# Altium schematic sheet SHEET_SYMBOL.SchDoc
size A3; SheetNumber: 1; SheetTotal: 10
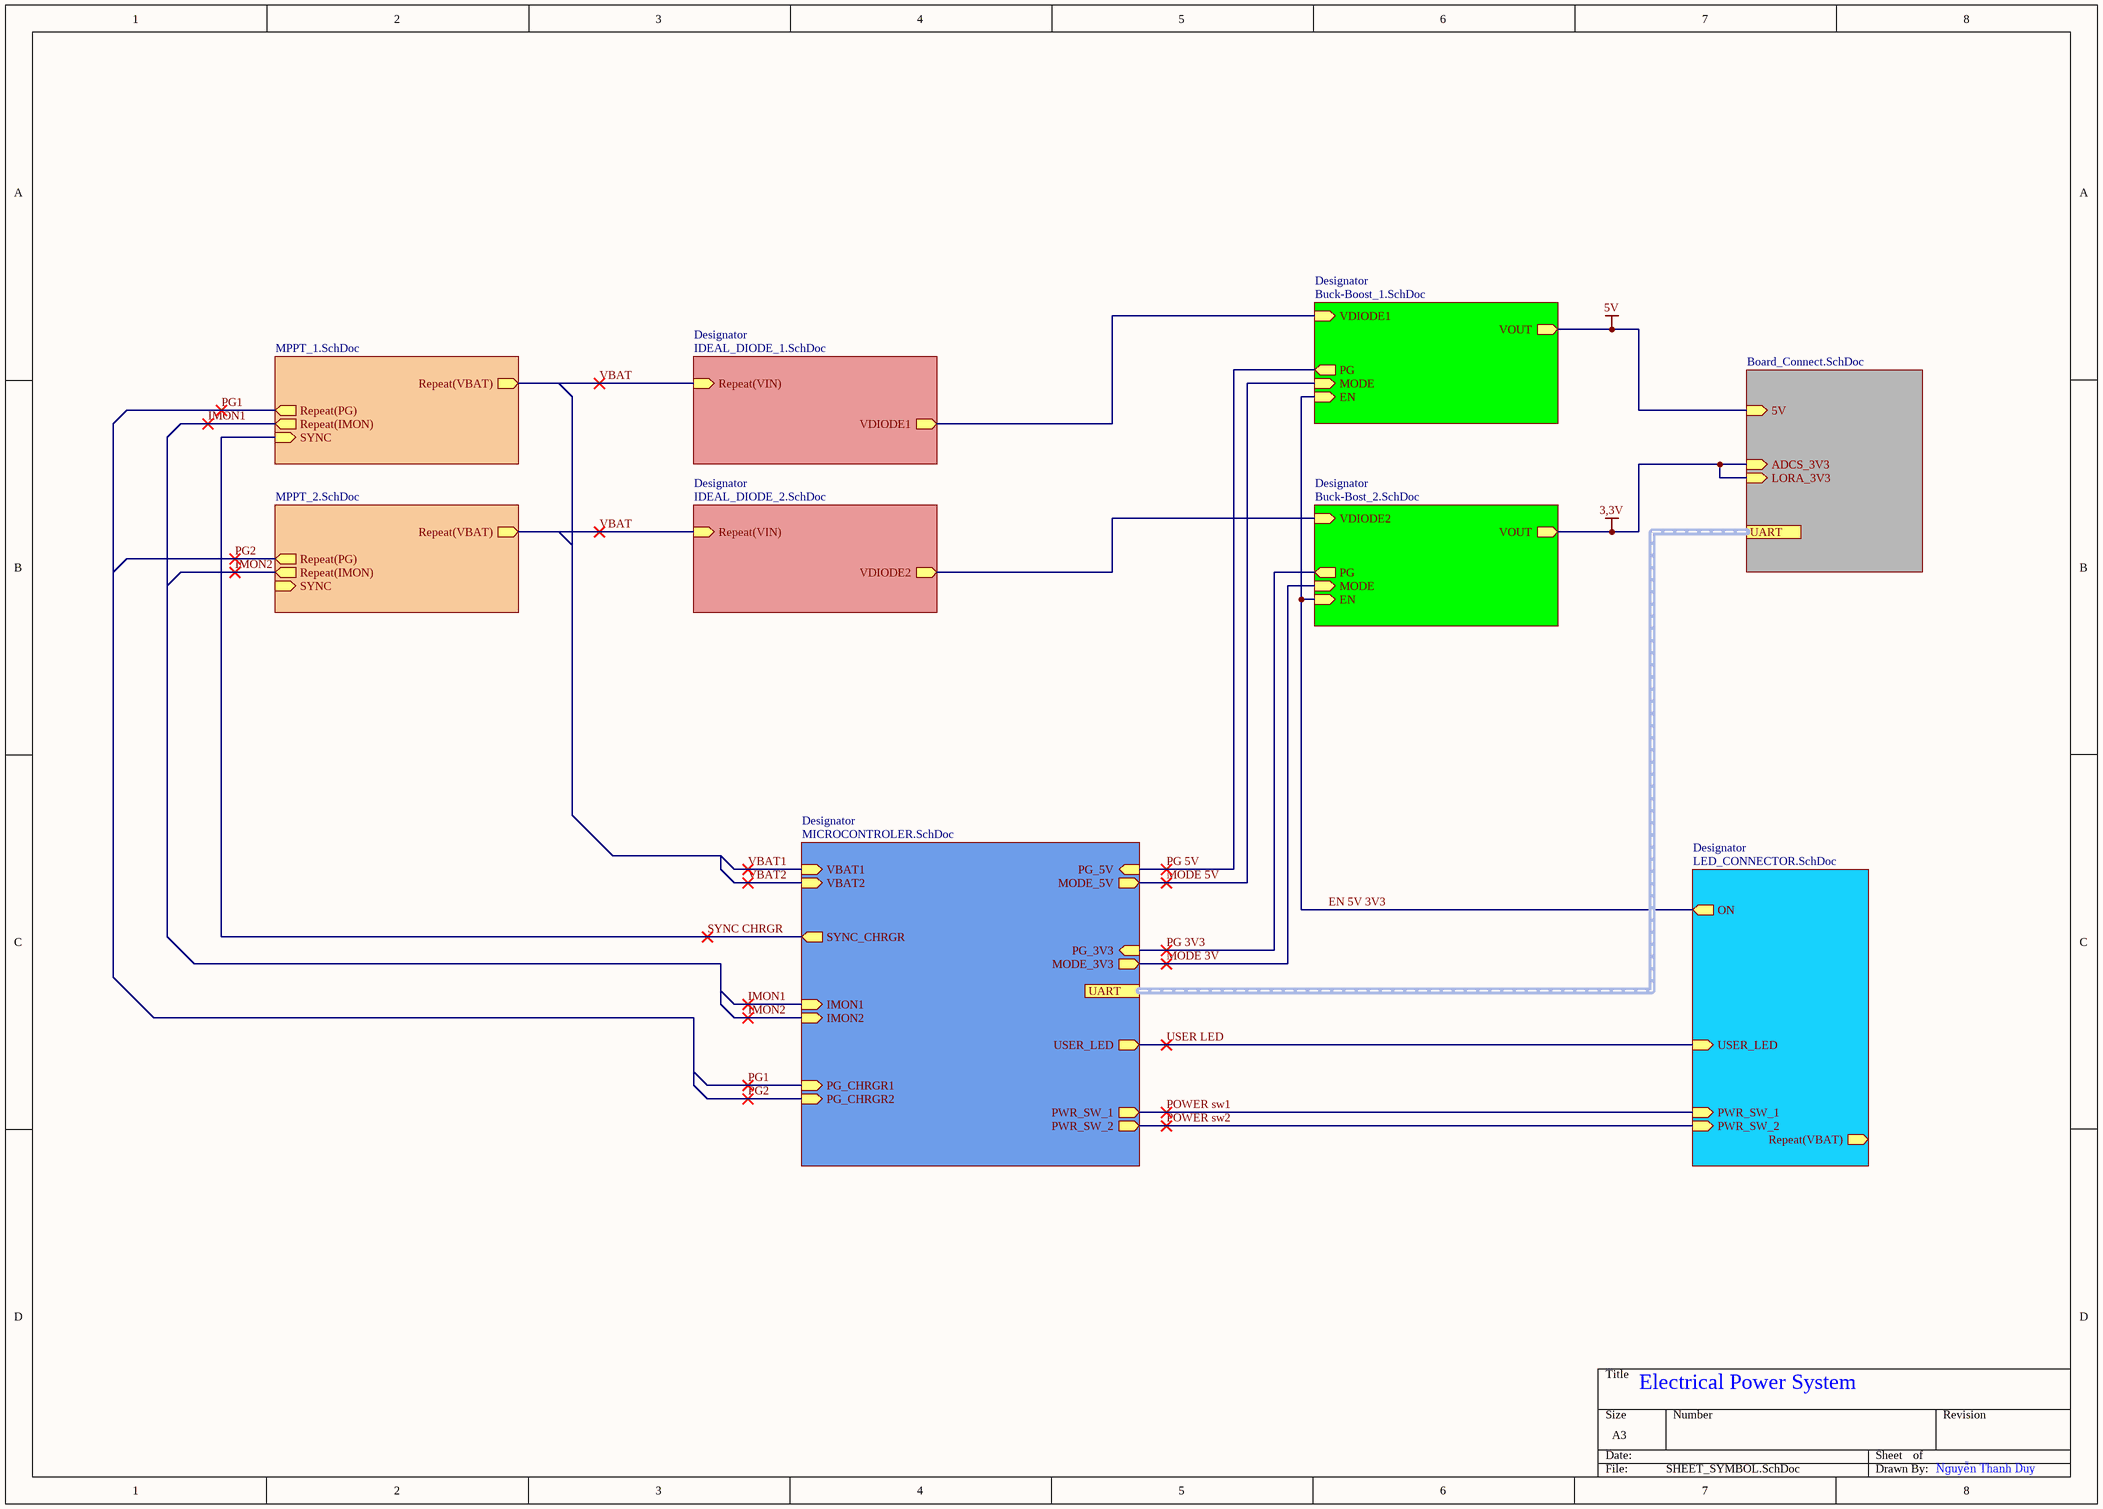
[diagram p0: SHEET_SYMBOL.SchDoc]

## Sub-sheets
Designator = MICROCONTROLER.SchDoc: VBAT1 (in), VBAT2 (in), SYNC_CHRGR (out), IMON1 (in), IMON2 (in), PG_CHRGR1 (in), PG_CHRGR2 (in), PG_5V (in), MODE_5V (out), PG_3V3 (in), MODE_3V3 (out), USER_LED (out), PWR_SW_1 (out), PWR_SW_2 (out)
Designator = MPPT_1.SchDoc: Repeat(PG) (out), Repeat(IMON) (out), Repeat(VBAT) (out), SYNC (in)
Designator = MPPT_2.SchDoc: Repeat(PG) (out), Repeat(IMON) (out), Repeat(VBAT) (out), SYNC (in)
Designator = IDEAL_DIODE_1.SchDoc: Repeat(VIN) (in), VDIODE1 (out)
Designator = IDEAL_DIODE_2.SchDoc: Repeat(VIN) (in), VDIODE2 (out)
Designator = Buck-Boost_1.SchDoc: VDIODE1 (in), PG (out), MODE (in), EN (in), VOUT (out)
Designator = Buck-Bost_2.SchDoc: VDIODE2 (in), PG (out), MODE (in), EN (in), VOUT (out)
Designator = Board_Connect.SchDoc: 5V (in), ADCS_3V3 (in), LORA_3V3 (in)
Designator = LED_CONNECTOR.SchDoc: ON (out), USER_LED (in), PWR_SW_1 (in), PWR_SW_2 (in), Repeat(VBAT) (out)

## Ports
UART (harness UART, see 1[5C], 3[2C], 10[1D]), UART (harness UART, see 1[7B], 3[2C], 10[1D])

## Nets
3,3V: sheet Designator/VOUT, sheet Designator/ADCS_3V3, sheet Designator/LORA_3V3
5V: sheet Designator/VOUT, sheet Designator/5V
EN 5V 3V3: sheet Designator/EN, sheet Designator/EN, sheet Designator/ON
IMON1: sheet Designator/IMON1, sheet Designator/Repeat(IMON)
IMON2: sheet Designator/IMON2, sheet Designator/Repeat(IMON)
MODE 3V: sheet Designator/MODE_3V3, sheet Designator/MODE
MODE 5V: sheet Designator/MODE_5V, sheet Designator/MODE
PG1: sheet Designator/PG_CHRGR1, sheet Designator/Repeat(PG)
PG2: sheet Designator/PG_CHRGR2, sheet Designator/Repeat(PG)
PG 3V3: sheet Designator/PG_3V3, sheet Designator/PG
PG 5V: sheet Designator/PG_5V, sheet Designator/PG
POWER sw1: sheet Designator/PWR_SW_1, sheet Designator/PWR_SW_1
POWER sw2: sheet Designator/PWR_SW_2, sheet Designator/PWR_SW_2
SYNC CHRGR: sheet Designator/SYNC_CHRGR, sheet Designator/SYNC
USER LED: sheet Designator/USER_LED, sheet Designator/USER_LED
VBAT: sheet Designator/Repeat(VBAT), sheet Designator/Repeat(VBAT), sheet Designator/Repeat(VIN), sheet Designator/Repeat(VIN)
VBAT1: sheet Designator/VBAT1
VBAT2: sheet Designator/VBAT2
(unnamed): sheet Designator/VDIODE1, sheet Designator/VDIODE1
(unnamed): sheet Designator/VDIODE2, sheet Designator/VDIODE2

## Notes on the sheet
- Electrical Power System
- Nguyễn Thanh Duy